# Altium schematic sheet pad_ecg_schematic.SchDoc
size A
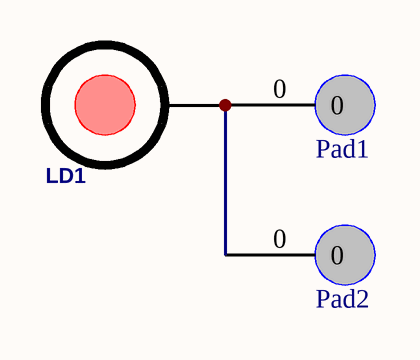
[diagram p0: pad_ecg_schematic.SchDoc]

## Parts
LD1  ECG LEAD  [ECG PAD]  (value not drawn)
Pad1  pad_ecg  [pad_ecg]  (value not drawn)
Pad2  pad_ecg  [pad_ecg]  (value not drawn)

## Nets
NetLD1_1: LD1.1 Pad1.0 Pad2.0